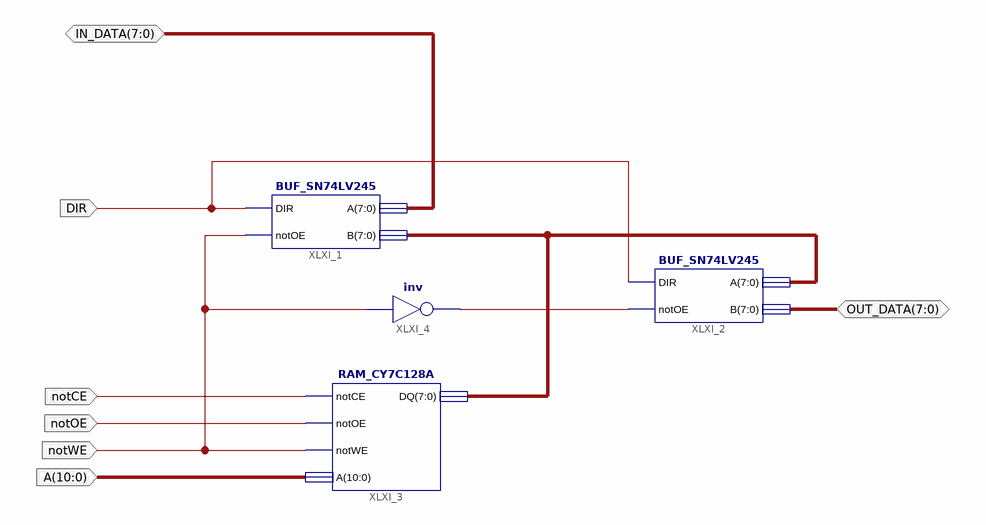
[diagram p0: schematic sheet 1]
// Xilinx ISE schematic RAM_UNIT.sch (spartan3a) as structural Verilog: 4 symbols, 7 ports
module RAM_UNIT (
  input  notCE,
  input  notOE,
  input  [10:0] A,
  input  notWE,
  input  DIR,
  inout  [7:0] OUT_DATA,
  inout  [7:0] IN_DATA
);

  wire XLXN_14;
  wire [7:0] XLXN_11;

  BUF_SN74LV245 XLXI_1 (.DIR(DIR), .notOE(notWE), .A(IN_DATA), .B(XLXN_11));
  BUF_SN74LV245 XLXI_2 (.DIR(DIR), .notOE(XLXN_14), .A(XLXN_11), .B(OUT_DATA));
  RAM_CY7C128A XLXI_3 (.notCE(notCE), .notOE(notOE), .notWE(notWE), .A(A), .DQ(XLXN_11));
  not XLXI_4 (XLXN_14, notWE);
endmodule
